# EAGLE design picopter_qc (EAGLE 6.5.0)
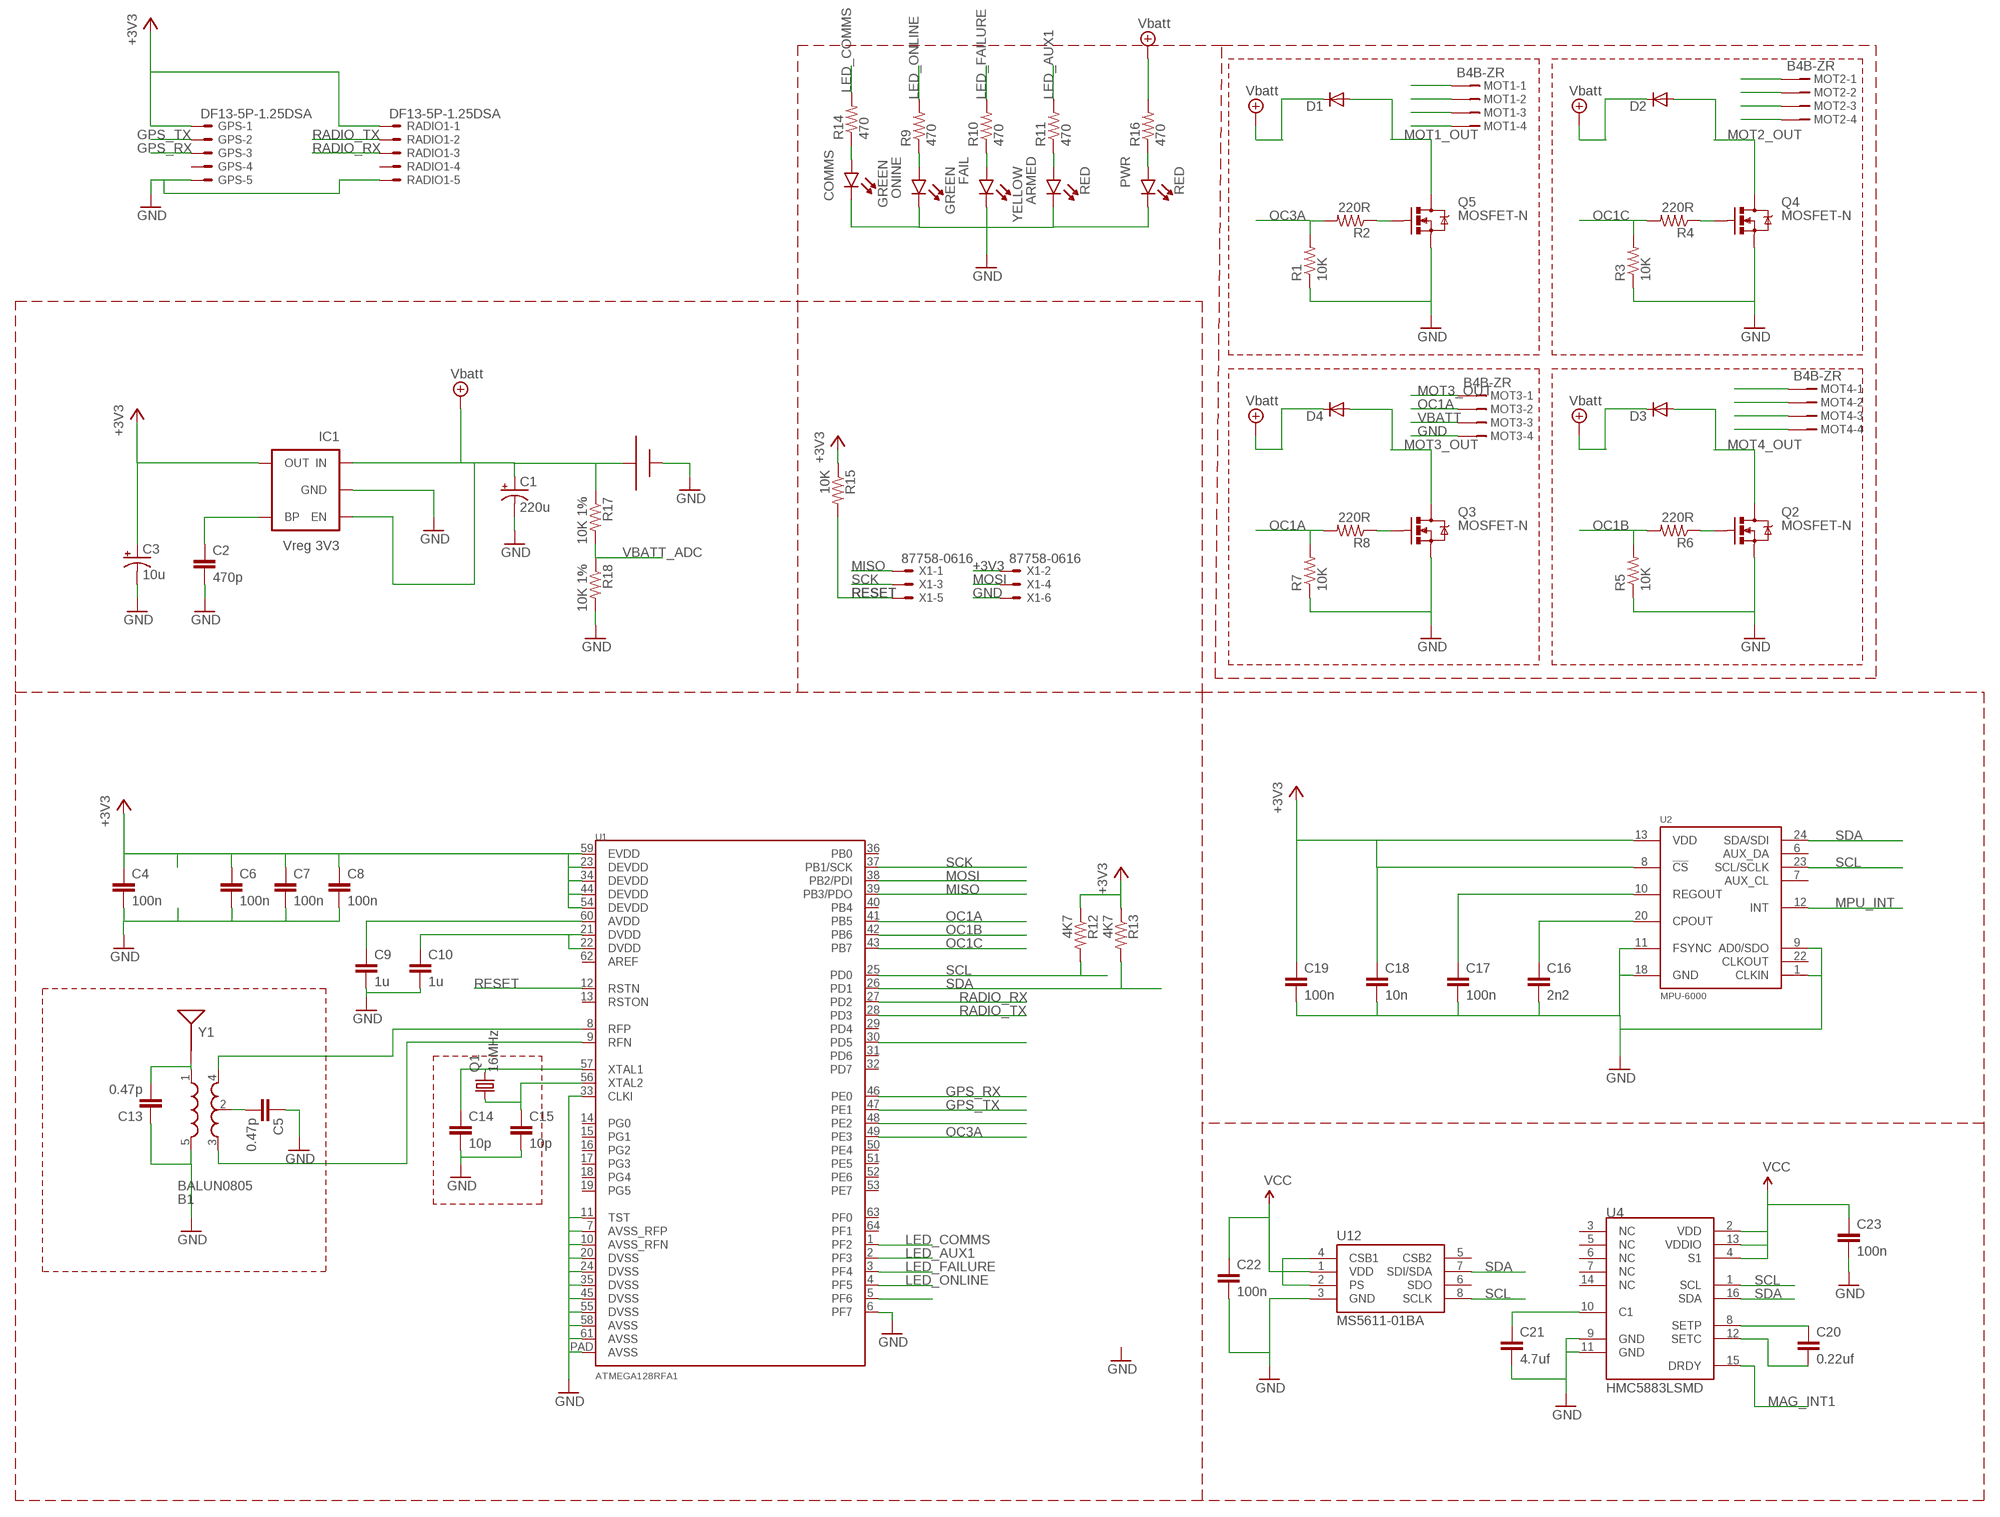
[diagram p0: schematic, sheet 1]

## Parts
ARMED  RED  SMD_LED0805  [LED0805]
B1  BALUN0805  [BALUN]
BATT1  BATT-CONNJST-PH-VERT  [JST-PH-2-VERT]
C1  220u  CPOL-USSMCB  [SMC_B]
C2  470p  C-EUC0603  [C0603]
C3  10u  CPOL-USSMCB  [SMC_B]
C4  100n  C-EUC0603  [C0603]
C5  0.47p  C-EUC0603  [C0603]
C6  100n  C-EUC0603  [C0603]
C7  100n  C-EUC0603  [C0603]
C8  100n  C-EUC0603  [C0603]
C9  1u  C-EUC0603  [C0603]
C10  1u  C-EUC0603  [C0603]
C13  0.47p  C-EUC0603  [C0603]
C14  10p  C-EUC0603  [C0603]
C15  10p  C-EUC0603  [C0603]
C16  2n2  C-EUC0603  [C0603]
C17  100n  C-EUC0603  [C0603]
C18  10n  C-EUC0603  [C0603]
C19  100n  C-EUC0603  [C0603]
C20  0.22uf  C-EUC0603  [C0603]
C21  4.7uf  C-EUC0603  [C0603]
C22  100n  C-EUC0603  [C0603]
C23  100n  C-EUC0603  [C0603]
COMMS  GREEN  SMD_LED0805  [LED0805]
D1  DIODE-MINIMELF  [MINIMELF]
D2  DIODE-MINIMELF  [MINIMELF]
D3  DIODE-MINIMELF  [MINIMELF]
D4  DIODE-MINIMELF  [MINIMELF]
FAIL  YELLOW  SMD_LED0805  [LED0805]
GPS  DF13-5P-1.25DSA  [DF13-5P-1.25DSA]
IC1  Vreg 3V3  V_REG_LDOSMD  [SOT23-5]
MOT1  B4B-ZR  [B4B-ZR]
MOT2  B4B-ZR  [B4B-ZR]
MOT3  B4B-ZR  [B4B-ZR]
MOT4  B4B-ZR  [B4B-ZR]
ONINE  GREEN  SMD_LED0805  [LED0805]
PWR  RED  SMD_LED0805  [LED0805]
Q1  16MHz  CRYSTALCTS406  [CTS406]
Q2  MOSFET-N  MOSFET-NCHANNELSMD  [SOT23-3]
Q3  MOSFET-N  MOSFET-NCHANNELSMD  [SOT23-3]
Q4  MOSFET-N  MOSFET-NCHANNELSMD  [SOT23-3]
Q5  MOSFET-N  MOSFET-NCHANNELSMD  [SOT23-3]
R1  10K  R-US_R0603  [R0603]
R2  220R  R-US_R0603  [R0603]
R3  10K  R-US_R0603  [R0603]
R4  220R  R-US_R0603  [R0603]
R5  10K  R-US_R0603  [R0603]
R6  220R  R-US_R0603  [R0603]
R7  10K  R-US_R0603  [R0603]
R8  220R  R-US_R0603  [R0603]
R9  470  RESISTOR0805-RES  [0805]
R10  470  RESISTOR0805-RES  [0805]
R11  470  RESISTOR0805-RES  [0805]
R12  4K7  R-US_R0603  [R0603]
R13  4K7  R-US_R0603  [R0603]
R14  470  RESISTOR0805-RES  [0805]
R15  10K  R-US_R0603  [R0603]
R16  470  RESISTOR0805-RES  [0805]
R17  10K 1%  R-US_R0603  [R0603]
R18  10K 1%  R-US_R0603  [R0603]
RADIO1  DF13-5P-1.25DSA  [DF13-5P-1.25DSA]
U1  ATMEGA128RFA1  [QFN-64]
U2  MPU-6000  [QFN-24]
U4  HMC5883LSMD  [16LPCC]
U12  MS5611-01BA  [MS5611-01BA]
X1  87758-0616  [87758-0616]
Y1  ANTENNA2SMD5  [ANTENNA-CHIP5]

## Nets
+3V3: C3.+ C4.1 C6.1 C7.1 C8.1 C18.1 C19.1 C22.1 C23.1 GPS.1 IC1.5(OUT) R12.1 R13.1 R15.1 RADIO1.1 U1.23(DEVDD) U1.34(DEVDD) U1.44(DEVDD) U1.54(DEVDD) U1.59(EVDD) U2.8(!CS) U2.13(VDD) U4.2(VDD) U4.4(S1) U4.13(VDDIO) U12.1(VDD) U12.2(PS) U12.4(CSB1) X1.2 ; supply symbol labelled VCC
GND: ARMED.C B1.5(GND) BATT1.N C1.- C2.2 C3.- C4.2 C5.1 C6.2 C7.2 C8.2 C9.2 C10.2 C13.1 C14.2 C15.2 C16.2 C17.2 C18.2 C19.2 C21.2 C22.2 C23.2 COMMS.C FAIL.C GPS.5 IC1.2(GND) MOT1.4 MOT2.4 MOT3.4 MOT4.4 ONINE.C PWR.C Q2.2(S) Q3.2(S) Q4.2(S) Q5.2(S) R1.1 R3.1 R5.1 R7.1 R18.2 RADIO1.5 U1.6(PF7) U1.7(AVSS_RFP) U1.10(AVSS_RFN) U1.11(TST) U1.20(DVSS) U1.24(DVSS) U1.33(CLKI) U1.35(DVSS) U1.45(DVSS) U1.55(DVSS) U1.58(AVSS) U1.61(AVSS) U1.PAD(AVSS) U2.1(CLKIN) U2.9(AD0/SDO) U2.11(FSYNC) U2.18(GND) U4.9(GND) U4.11(GND) U12.3(GND) X1.6
GPS_RX: GPS.3 U1.46(PE0)
GPS_TX: GPS.2 U1.47(PE1)
LED_AUX1: R11.2 U1.2(PF3)
LED_COMMS: R14.2 U1.1(PF2)
LED_FAILURE: R10.2 U1.3(PF4)
LED_ONLINE: R9.2 U1.4(PF5)
MAG_INT1: U1.48(PE2) U4.15(DRDY)
MISO: U1.39(PB3/PDO) X1.1
MOSI: U1.38(PB2/PDI) X1.4
MOT1_OUT: D1.A MOT1.1 Q5.3(D)
MOT2_OUT: D2.A MOT2.1 Q4.3(D)
MOT3_OUT: D4.A MOT3.1 Q3.3(D)
MOT4_OUT: D3.A MOT4.1 Q2.3(D)
MPU_INT: U1.30(PD5) U2.12(INT)
MS1: B1.1(IN) C13.2 Y1.FEED(SIGNAL)
N$1: C2.1 IC1.4(BP)
N$2: B1.2(GND) C5.2
N$4: C10.1 U1.21(DVDD) U1.22(DVDD)
N$5: C9.1 U1.60(AVDD)
N$6: B1.3(OUT1) U1.9(RFN)
N$7: B1.4(OUT2) U1.8(RFP)
N$9: C14.1 Q1.3 U1.57(XTAL1)
N$10: C15.1 Q1.1 U1.56(XTAL2)
N$12: ONINE.P$1(A) R9.1
N$13: FAIL.P$1(A) R10.1
N$15: C20.1 U4.8(SETP)
N$16: C16.1 U2.20(CPOUT)
N$17: C17.1 U2.10(REGOUT)
N$18: C20.2 U4.12(SETC)
N$19: C21.1 U4.10(C1)
N$20: ARMED.P$1(A) R11.1
N$22: COMMS.P$1(A) R14.1
N$23: PWR.P$1(A) R16.1
N$45: Q5.1(G) R2.1
N$46: Q4.1(G) R4.1
N$47: Q2.1(G) R6.1
N$48: Q3.1(G) R8.1
OC1A: MOT3.2 R7.2 R8.2 U1.41(PB5)
OC1B: MOT4.2 R5.2 R6.2 U1.42(PB6)
OC1C: MOT2.2 R3.2 R4.2 U1.43(PB7)
OC3A: MOT1.2 R1.2 R2.2 U1.49(PE3)
RADIO_RX: RADIO1.3 U1.27(PD2)
RADIO_TX: RADIO1.2 U1.28(PD3)
RESET: R15.2 U1.12(RSTN) X1.5
SCK: U1.37(PB1/SCK) X1.3
SCL: R12.2 U1.25(PD0) U2.23(SCL/SCLK) U4.1(SCL) U12.8(SCLK)
SDA: R13.2 U1.26(PD1) U2.24(SDA/SDI) U4.16(SDA) U12.7(SDI/SDA)
VBATT: BATT1.P C1.+ D1.C D2.C D3.C D4.C IC1.1(IN) IC1.3(EN) MOT1.3 MOT2.3 MOT3.3 MOT4.3 R16.2 R17.1 ; supply symbol labelled Vbatt
VBATT_ADC: R17.2 R18.1 U1.5(PF6)
Unconnected: GPS.4 RADIO1.4 U1.13(RSTON) U1.14(PG0) U1.15(PG1) U1.16(PG2) U1.17(PG3) U1.18(PG4) U1.19(PG5) U1.29(PD4) U1.31(PD6) U1.32(PD7) U1.36(PB0) U1.40(PB4) U1.50(PE4) U1.51(PE5) U1.52(PE6) U1.53(PE7) U1.62(AREF) U1.63(PF0) U1.64(PF1) U2.6(AUX_DA) U2.7(AUX_CL) U2.22(CLKOUT) U4.3(NC) U4.5(NC) U4.6(NC) U4.7(NC) U4.14(NC) U12.5(CSB2) U12.6(SDO)

## Library data of the parts
ARMED COMMS FAIL ONINE PWR = SoftwareLogisticsParts:SMD_LED0805
B1 = palmquad_alpha:BALUN
BATT1 = palmquad_alpha:BATT-CONN
C1 C3 = rcl:CPOL-US: POLARIZED CAPACITOR, American symbol
C2 C4-C10 C13-C23 = rcl:C-EU: CAPACITOR, European symbol
D1-D4 = palmquad_alpha:DIODE-: DIODE
GPS RADIO1 = pixhawk2:DF13-5P-1.25?
IC1 = palmquad_alpha:V_REG_LDO: Voltage Regulator LDO Standard 150mA LDO voltage regulator in SOT-23 layout. Micrel part MIC5205. BP (by-pass) pin is used to lower output noise with 470pF cap.
MOT1-MOT4 = con-jst:?4B-ZR: ZH CONNECTOR 1.5 mm, 4 pin 1 row Source: http://www.jst.com .. eZH.pdf; MF: FARNELL; MPN: B4B-ZR(LF)(SN); OC_FARNELL: 1830916; OC_NEWARK: 37K9960
Q1 = palmquad_alpha:CRYSTAL: CRYSTAL; OC_FARNELL: unknown; OC_NEWARK: unknown
Q2-Q5 = palmquad_alpha:MOSFET-NCHANNEL
R1-R8 R12 R13 R15 R17 R18 = rcl:R-US_: RESISTOR, American symbol
R9-R11 R14 R16 = SparkFun-Passives:RESISTOR: Resistor Basic schematic elements and footprints for 0603, 1206, and PTH resistors.
U1 = palmquad_alpha:ATMEGA128RFA1
U2 = palmquad_alpha:MPU-6000: ITG-3200 3-axis gyro, digital output, qfn24 package
U4 = SparkFun-Sensors:HMC5883L: 3 Axis Digital Compass IC
U12 = 3DRobotics:MS5611-01BA: MS5611-01BA The MS5611-01BA is a new generation of high resolution altimeter sensors from MEAS Switzerland with SPI and I 2 C bus interface. It is optimized for altimeters and variometers with an altitude resolution of 10 cm. The sensor module includes a high linearity pressure sensor and an ultra low power 24 bit ?? ADC with internal factory calibrated coefficients. It provides a precise digital 24 Bit pressure and temperature value and different operation modes that allow the user to optimize for conversion speed and current consumption. A high resolution temperature output allows the implementation of an altimeter/thermometer function without any additional sensor. The MS5611-01BA can be interfaced to virtually any microcontroller. The communication protocol is simple, without the need of programming internal registers in the device. Small dimensions of only 5.0 mm x 3.0 mm and a height of 1.7 mm allow for integration in mobile devices. This new sensor module generation is based on leading MEMS technology and latest benefits from MEAS Switzerland proven experience and know-how in high volume manufacturing of altimeter modules, which have been widely used for over a decade. The sensing principle employed leads to very low hysteresis and high stability of both pressure and temperature signal. High resolution module, 10 cm Fast conversion down to 1 ms Low power, 1 µA (standby < 0.15 µA) QFN package 5.0 x 3.0 x 1.7 mm3 Supply voltage 1.8 to 3.6 V Integrated digital pressure sensor (24 bit ?? ADC) Operating range: 10 to 1200 mbar, -40 to +85 °C I2C and SPI interface up to 20 MHz No external components (Internal oscillator) Excellent long term stability; DATASHEET: http://www.meas-spec.com/downloads/MS5611-01BA01.pdf; LINK: http://www.meas-spec.com/product/t_product.aspx?id=8503#; MFGPN: MS5611-01BA
X1 = con-molex:87758-0616: 6 Pin - 2mm Dual Row Single Wafer, Vertical T/H HDR Source: http://www.molex.com/pdm_docs/sd/877580616_sd.pdf; MPN: 87758-0616; OC_FARNELL: 7472323; OC_NEWARK: 25M5667
Y1 = palmquad_alpha:ANTENNA2: Antenna Single endded antenna. Common with smaller chip antennas. CHIP4 package is the GPS Chip Antenna SKU: GPS-08418. CHIP5 package is 2.4GHz chip antenna SKU: WRL-00144.

## Board
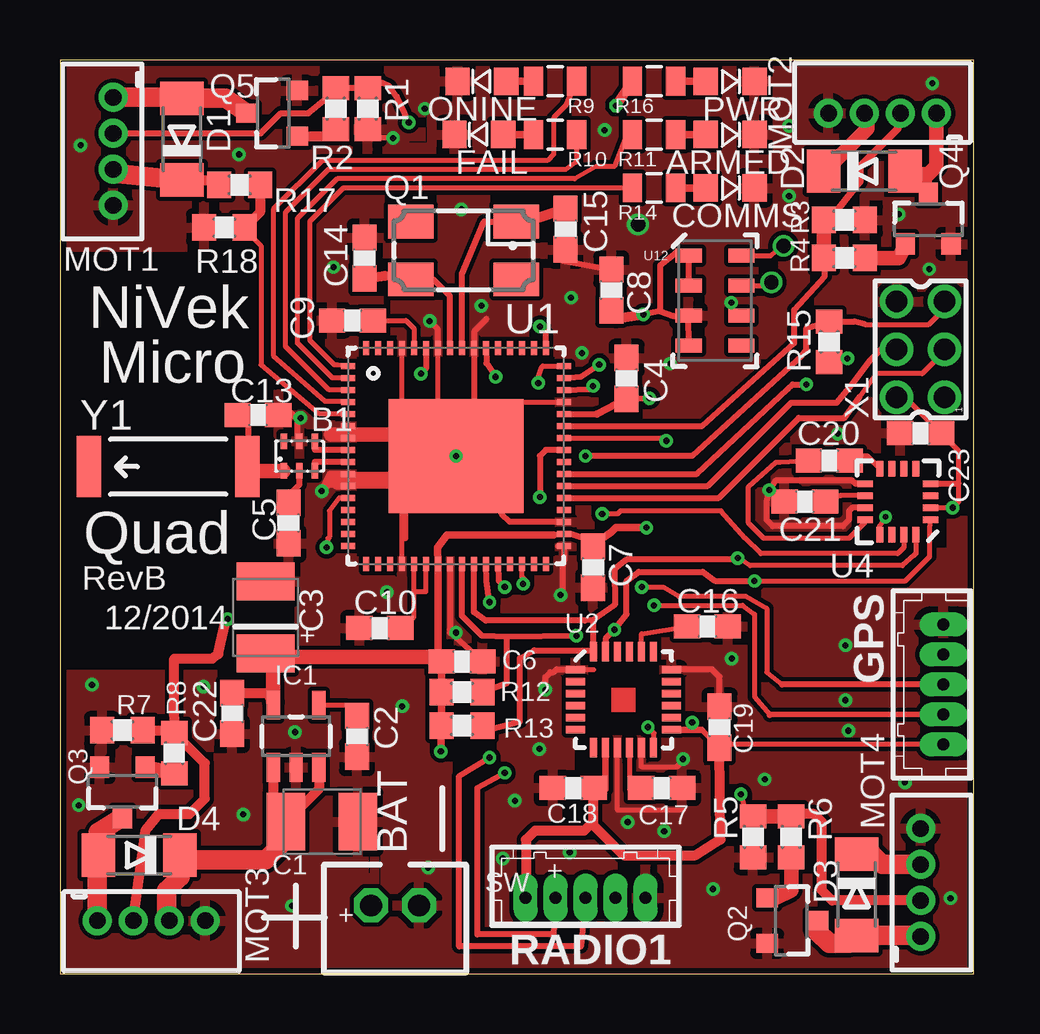
[diagram p1: board, top side]
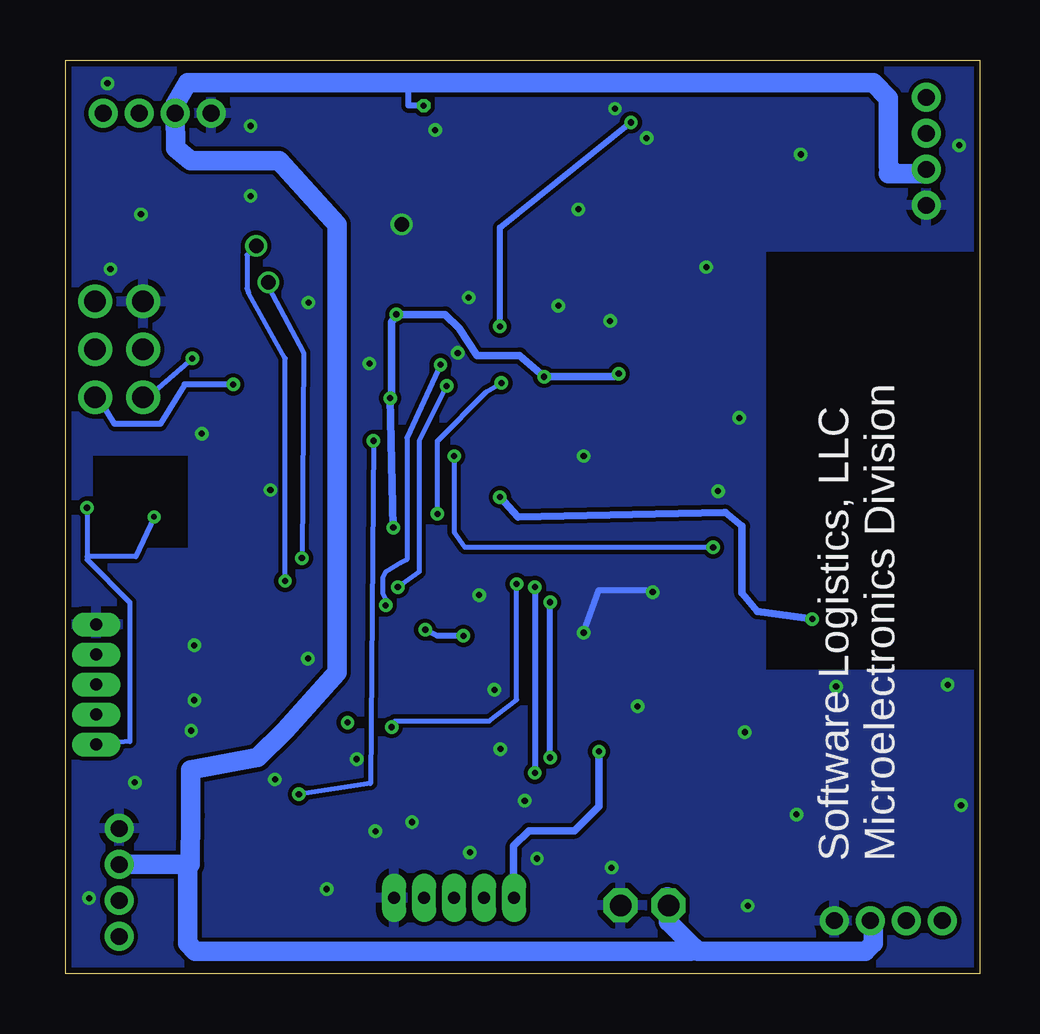
[diagram p2: board, bottom side, seen from below]

Size 38.1 x 38.1 mm. Coordinates in mm from the lower left corner, seen from the top.
Outline: 0,38.1 0,0 38.1,0 38.1,38.1 0,38.1
Copper layers (1*16): Top 0.035mm / dielectric 1.5mm / Bottom 0.035mm
Design rules "fusion_rules_tentedvias *": minimum track width 6mil, minimum drill 10mil, track to track 7mil, track to pad 7mil, pad to pad 7mil, via to via 7mil, smd to smd 0mil, copper to edge 10mil, drill to drill 10mil, minimum pad ring 10mil, minimum via ring 6mil, stop-mask expansion 2mil, vias tented up to drill 12mil, thermal gap 10mil
tRestrict: area 12.4,17.4 to 20.6,25.7; area 22,10 to 25,12.9; area 33,17.8 to 37,21.6; area 0.1,12.7 to 8.9,30.1; 25 lines
bRestrict: area 33,17.8 to 37,21.6; area 0.1,12.7 to 8.9,30.1

### Footprints (pad centres in the part's own frame; a part is rotated, then mirrored left to right if it is on the bottom)
LED0805 = smd 1.143 x 1.016: C 0,1.016; P$1 0,-1.016
BALUN = smd 0.27 x 0.635: 1 -0.7,-0.616; 2 -0.05,-0.616; 3 0.6,-0.616; 4 0.6,0.616; 5 -0.05,0.616; 6 -0.7,0.616
JST-PH-2-VERT = drill 0.9 pad 1.422 octagon: N -1,0; P 1,0
SMC_B = smd 1.6 x 2.4: + -1.5,0; - 1.5,0
C0603 = smd 1.1 x 1: 1 -0.85,0; 2 0.85,0
MINIMELF = smd 1.4 x 1.8: A 1.7,0; C -1.7,0
DF13-5P-1.25DSA = drill 0.5 pad 0.8 long: 1 -2.5,0; 2 -1.25,0; 3 0,0; 4 1.25,0; 5 2.5,0
SOT23-5 = smd 0.55 x 1.2: 1 -0.95,-1.3; 2 0,-1.3; 3 0.95,-1.3; 4 0.95,1.3; 5 -0.95,1.3
B4B-ZR = drill 0.7 pad 1.1: 1 -2.25,0; 2 -0.75,0; 3 0.75,0; 4 2.25,0
CTS406 = smd 1.9 x 1.4: 1 -2.2,-1.2; 2 2.2,-1.2; 3 2.2,1.2; 4 -2.2,1.2
SOT23-3 = smd 0.8 x 0.9: 1 -0.95,-1; 2 0.95,-1; 3 0,1.1
R0603 = smd 1 x 1.1: 1 -0.85,0; 2 0.85,0
0805 = smd 0.8 x 1.2: 1 -0.9,0; 2 0.9,0
QFN-64 = smd 0.6 x 0.25: 1 -4.5,3.75; 2 -4.5,3.25; 3 -4.5,2.75; 4 -4.5,2.25; 5 -4.5,1.75; 6 -4.5,1.25; 7 -4.5,0.75; 8 -4.5,0.25; 9 -4.5,-0.25; 10 -4.5,-0.75; 11 -4.5,-1.25; 12 -4.5,-1.75; 13 -4.5,-2.25; 14 -4.5,-2.75; 15 -4.5,-3.25; 16 -4.5,-3.75; 33 4.5,-3.75; 34 4.5,-3.25; 35 4.5,-2.75; 36 4.5,-2.25; 37 4.5,-1.75; 38 4.5,-1.25; 39 4.5,-0.75; 40 4.5,-0.25; 41 4.5,0.25; 42 4.5,0.75; 43 4.5,1.25; 44 4.5,1.75; 45 4.5,2.25; 46 4.5,2.75; 47 4.5,3.25; 48 4.5,3.75 | smd 0.25 x 0.6: 17 -3.75,-4.5; 18 -3.25,-4.5; 19 -2.75,-4.5; 20 -2.25,-4.5; 21 -1.75,-4.5; 22 -1.25,-4.5; 23 -0.75,-4.5; 24 -0.25,-4.5; 25 0.25,-4.5; 26 0.75,-4.5; 27 1.25,-4.5; 28 1.75,-4.5; 29 2.25,-4.5; 30 2.75,-4.5; 31 3.25,-4.5; 32 3.75,-4.5; 49 3.75,4.5; 50 3.25,4.5; 51 2.75,4.5; 52 2.25,4.5; 53 1.75,4.5; 54 1.25,4.5; 55 0.75,4.5; 56 0.25,4.5; 57 -0.25,4.5; 58 -0.75,4.5; 59 -1.25,4.5; 60 -1.75,4.5; 61 -2.25,4.5; 62 -2.75,4.5; 63 -3.25,4.5; 64 -3.75,4.5 | smd 5.639 x 4.75: PAD 0,0
QFN-24 = smd 0.8 x 0.3: 1 -2,1.25; 2 -2,0.75; 3 -2,0.25; 4 -2,-0.25; 5 -2,-0.75; 6 -2,-1.25; 13 2,-1.25; 14 2,-0.75; 15 2,-0.25; 16 2,0.25; 17 2,0.75; 18 2,1.25 | smd 0.3 x 0.8: 7 -1.25,-2; 8 -0.75,-2; 9 -0.25,-2; 10 0.25,-2; 11 0.75,-2; 12 1.25,-2; 19 1.25,2; 20 0.75,2; 21 0.25,2; 22 -0.25,2; 23 -0.75,2; 24 -1.25,2
16LPCC = smd 0.65 x 0.28: 1 -1.37,0.75; 2 -1.37,0.25; 3 -1.37,-0.25; 4 -1.37,-0.75; 9 1.37,-0.75; 10 1.37,-0.25; 11 1.37,0.25; 12 1.37,0.75 | smd 0.28 x 0.65: 5 -0.75,-1.37; 6 -0.25,-1.37; 7 0.25,-1.37; 8 0.75,-1.37; 13 0.75,1.37; 14 0.25,1.37; 15 -0.25,1.37; 16 -0.75,1.37
MS5611-01BA = smd 1.1 x 0.6: 1 -1.1,1.875; 2 -1.1,0.625; 3 -1.1,-0.625; 4 -1.1,-1.875; 5 1.1,-1.875; 6 1.1,-0.625; 7 1.1,0.625; 8 1.1,1.875
87758-0616 = drill 0.9 pad 1.27: 1 -2,-1; 2 -2,1; 3 0,-1; 4 0,1; 5 2,-1; 6 2,1
ANTENNA-CHIP5 = smd 1.016 x 2.54: FEED -3.302,0; NC 3.302,0

### Placement (x,y rotation side)
ARMED  27.94,34.99 270 top
B1  10.03,21.59 0 top
BATT1  13.97,2.86 180 top
C1  10.92,6.35 0 top
C2  12.38,9.91 270 top
C3  8.57,14.86 90 top
C4  23.62,24.83 90 top
C5  9.53,18.8 90 top
C6  16.76,13.02 0 top
C7  22.23,16.95 270 top
C8  22.99,28.51 90 top
C9  12.19,27.24 180 top
C10  13.34,14.41 180 top
C13  8.26,23.3 180 top
C14  12.7,29.84 90 top
C15  21.08,31.05 270 top
C16  26.99,14.48 0 top
C17  25.08,7.75 0 top
C18  21.4,7.75 180 top
C19  27.5,10.29 90 top
C20  32.07,21.4 180 top
C21  31.05,19.68 180 top
C22  7.18,10.86 270 top
C23  35.88,22.54 180 top
COMMS  27.94,32.77 270 top
D1  5.08,34.8 90 top
D2  33.53,33.46 0 top
D3  33.21,3.3 270 top
D4  3.3,4.95 180 top
FAIL  17.46,34.99 90 top
GPS  36.83,12.06 90 top
IC1  9.84,9.91 0 top
MOT1  2.22,34.29 270 top
MOT2  34.29,35.88 180 top
MOT3  3.81,2.22 0 top
MOT4  35.88,3.81 90 top
ONINE  17.59,37.21 90 top
PWR  27.94,37.21 270 top
Q1  16.83,30.16 180 top
Q2  30.48,2.22 270 top
Q3  2.6,7.62 180 top
Q4  36.2,31.43 0 top
Q5  8.89,35.88 90 top
R1  12.83,36.07 90 top
R2  11.49,36.07 90 top
R3  32.7,31.43 180 top
R4  32.7,29.84 180 top
R5  28.89,5.71 90 top
R6  30.48,5.71 90 top
R7  2.6,10.16 0 top
R8  4.76,9.21 90 top
R9  20.64,37.21 0 top
R10  20.64,34.99 0 top
R11  24.77,34.99 180 top
R12  16.76,11.75 0 top
R13  16.76,10.35 0 top
R14  24.77,32.77 180 top
R15  32.07,26.35 90 top
R16  24.77,37.21 180 top
R17  7.49,32.89 0 top
R18  6.86,31.11 180 top
RADIO1  21.91,3.17 0 top
U1  16.51,21.59 0 top
U2  23.5,11.43 0 top
U4  34.92,19.68 180 top
U12  27.3,28.07 0 top
X1  35.88,26.04 90 top
Y1  4.51,21.15 180 top

### Tracks (layer width: path | path; a pad name or v marks a point on that pad's centre or on a via)
+3V3  (via drill 0.23, 0.25)
  Top 0.203: 22.23,18.21 C7.1 22.52,18.1 | 22.75,7.68 C18.1 22.23,7.72 | C19.1 26.75,10.18 | 27.56,9.34 27.18,9.34 C19.1 | 15.91,11.81 15.66,11.75 R12.1 | 15.91,10.24 15.98,10.13 | X1.2 35.23,24.04 C23.1 37.47,21.8 37.47,20.45 37.47,19.68 v37.22,19.43 U4.2 | v32.83,25.65 32.17,25.4 R15.1 | 26.35,26.17 U12.4 | GPS.1 27.37,9.56 C19.1 | 26.33,10.18 v26.35,10.48 | U4.13 34.17,18.68 v34.42,19.05
  Top 0.254: 22.23,18.21 21.84,18.16 21.28,18.34 U1.34 20.57,18.29 | U1.44 22.39,23.34 | C4.1 v24.57,24 | U1.59 15.26,25.23 v15.05,25.02 | 25.02,27.62 25.02,29.53 25.69,30.07 U12.1 U12.2 | 25.02,27.62 25.59,27.43 26.18,27.43 U12.4 | 25.02,27.62 v24.32,27.5 | U1.54 17.78,25.45 v18.16,24.89 | U4.4 36.3,20.45 37.47,20.45
  Top 0.279: 26.75,10.18 26.33,10.18 U2.13 | U2.8 22.75,7.68
  Top 0.305: 22.39,23.34 C4.1 | 8.89,13.21 8.89,13.36 C3.+ 8.89,13.04 | IC1.5 8.89,11.33 | 15.91,13.21 C6.1 | C6.1 R12.1 | 15.98,10.13 R13.1 | 15.91,11.81 R12.1 | R12.1 R13.1 | R13.1 15.91,10.24 | v15.88,9.27 R13.1 | 20.57,18.29 16.13,18.29 15.75,17.78 U1.23 15.76,13.17 C6.1 | v24.45,18.61 23.18,18.61 22.99,18.41 22.52,18.1
  Top 0.406: C22.1 8.63,11.71 IC1.5 | v24.32,27.5 23.18,27.3 22.95,27.53 | 22.95,27.53 22.86,27.62 | C19.1 27.54,5.61 26.5,4.95 23.5,4.95 22.23,6.22 22.23,6.35 | 22.23,7.72 22.23,6.35 | 22.23,6.35 21.84,5.97 19.8,5.97 19.42,5.59 19.42,3.19 RADIO1.1 | C8.1 22.95,27.66 22.95,27.53
  Top 0.61: 15.91,13.21 8.89,13.21 8.89,11.33
  Bottom 0.203: X1.2 34.7,24.04 v32.83,25.65 | v37.22,19.43 37.22,17.4 | 37.22,17.4 37.22,17.28 35.43,15.49 35.43,9.69 GPS.1 | v34.42,19.05 35.18,17.4 37.22,17.4
  Bottom 0.305: v15.05,25.02 15.24,24.89 v18.16,24.89 19.18,25.78 20.95,25.78 21.72,26.92 22.29,27.5 v24.32,27.5 24.51,27.18 24.51,24 v24.57,24 v24.45,18.61 | RADIO1.1 19.43,4.95 19.43,5.33 18.8,5.97 16.89,5.97 15.88,6.99 v15.88,9.27
GND  (via drill 0.25, 0.6)
  Top 0.203: 14.26,17.27 14.26,19.3 14.26,19.46 | 18.77,23.84 20.96,23.84 | 17.27,23.77 17.27,25.91 17.27,25.95 | 15.76,23.72 15.76,25.91 | 14.26,23.75 14.26,25.93 | 12.09,20.84 14.27,20.84 | 12.14,20.34 14.33,20.34 | 12.11,22.34 14.3,22.34 | 20.73,17.83 20.8,17.83 | 22.25,12.68 21.69,12.68 | 16.26,17.14 16.26,17.18 | 24.24,9.21 24.24,8.63 25.71,8.63 | U2.9 23.25,6.83 25.98,6.83 | v10.02,23.18 9.97,23.18 9.91,23.11
  Top 0.254: U1.45 20.96,23.84 | 18.77,23.84 17.33,23.84 17.27,23.77 | 17.27,25.91 17.26,25.91 U1.55 17.26,23.63 17.27,23.62 15.86,23.62 15.76,23.72 | 15.76,25.91 U1.58 15.76,26.87 v15.41,27.22 | U1.61 14.26,25.93 | 14.26,22.73 14.26,22.48 14.26,19.31 14.26,19.3 | 14.26,19.46 14.26,19.65 14.22,19.68 14.22,20.24 14.33,20.34 | 12.14,20.34 U1.11 | U1.11 | 11.88,20.34 | 14.39,22.48 14.39,22.61 14.26,22.73 | 14.39,22.48 14.39,18.16 | 14.26,23.75 14.26,22.73 | 14.3,22.34 14.3,22.39 14.39,22.48 | 12.11,22.34 U1.7 U1.6 | v13.89,34.84 12.87,34.88 12.95,35.43 R1.1 | 20.8,17.83 U1.33 21.01,17.2 20.95,17.14 20.95,15.88 v20.87,15.79 | U1.24 16.26,17.14 16.26,14.22 v16.51,14.22 16.26,14.35 16.28,14.22 C6.2 | 14.26,17.27 U1.20 | 21.69,12.68 U2.1 21.48,12.7 20.7,12.7 20.57,12.57 20.45,12.57 20.24,12.36 v20.24,11.84 | C19.2 27.5,12.38 27.18,12.7 25.52,12.7 U2.18 | v25.97,8.95 25.97,8.89 25.71,8.63 | U2.11 24.25,9.22 24.24,9.21 | U2.9 | U4.9 33.16,20.43 33.02,20.57 29.83,20.56 v29.57,20.17 29.46,19.69 29.46,18.92 29.72,18.67 32.64,18.67 32.89,18.92 32.89,19.3 33.02,19.43 U4.11 | 12.09,20.84 U1.10 11.24,20.84 v10.91,20.13 11.37,20.51 11.54,20.34 11.88,20.34 | U1.11 11.88,20.34 | C15.2 20.95,29.74 C8.2 | U1.35 18.75,18.84 18.41,19.18 18.41,20.57 17.78,21.21 16.89,21.21 U1.PAD | 17.27,26.04 17.27,26.8 17.78,27.3 | B1.5 9.91,22.28 9.91,23.11 9.49,23.53 C13.1
  Top 0.305: 11.3,20.57 11.54,20.34 U1.11
  Top 0.61: 11.3,22.48 14.26,22.48 | 11.3,20.57 14.86,20.57
  Bottom 0.254: v16.51,14.22 15.88,16 13.72,16 13.59,15.75 13.55,15.88 v13.63,15.92
  other vias: 17.57,27.86 1.33,12.06 15.35,4.43 32.75,13.7 14.27,11.16 21.76,25.89 18.46,4.81 5.99,11.98 16.51,21.59 25.44,25.44 32.43,22.52 36.36,37.13 36.24,29.38 9.67,2.84 7.64,6.65 0.78,7.03 37.13,3.16 27.98,27.98 25.19,5.95 21.25,5.06 28,13.14 15.21,36.07 7.46,34.16 11.4,29.46 32.75,11.41 32.87,10.14 22.7,35.18 24.1,31.24 16.73,31.88 0.86,34.54 30.4,35.35 34.97,31.67 30.4,32.43 21.3,28.19 29.38,8.11 35.22,7.98 27.22,3.54 23.66,6.33 19.98,9.38 18.97,7.22 9.8,10.08
  pour Top: -0.13,38.23 37.97,38.23 38.1,38.1 38.1,0.13 0.25,0.13 0.13,0
  pour Bottom: -0.51,38.23 38.1,38.23 38.23,38.35 38.23,-0.38 38.48,-0.64 -0.64,-0.64
GPS_RX  (via drill 0.25)
  Top 0.203: 22.1,24.38 v22.23,24.51 | v24.26,16.13 25.15,16.13 25.78,15.75 28.57,15.75 29.46,15.24 29.46,12.57 30.1,12.06
  Top 0.254: GPS.3 30.1,12.06 | U1.46 22.1,24.38
  Bottom 0.203: v22.23,24.51 23.37,22.23 23.37,16.76 v24.26,16.13
GPS_TX  (via drill 0.25)
  Top 0.203: v24.77,15.37 28.45,15.37 28.96,14.99 28.96,11.56 29.59,10.79
  Top 0.254: GPS.2 29.59,10.79 | U1.47 21.72,24.89 v22.48,25.4
  Bottom 0.203: v22.48,25.4 23.88,22.35 23.88,17.27 24.13,17.14 24.77,16.76 24.89,16.51 24.89,15.88 24.77,15.62 v24.77,15.37
LED_AUX1
  Top 0.203: R11.2 23.69,35.12 23.11,33.66 22.35,33.66 21.46,33.15 11.56,33.15 9.91,31.5 9.91,26.29 11.36,24.84 U1.2
LED_COMMS
  Top 0.203: R14.2 11.81,32.77 10.41,31.37 10.41,26.42 11.43,25.4 11.57,25.4 U1.1
LED_FAILURE
  Top 0.203: R10.2 21.54,33.86 21.08,33.53 11.18,33.53 9.4,31.75 9.4,26.16 11.22,24.34 U1.3
LED_ONLINE
  Top 0.203: R9.2 21.08,36.2 20.57,35.69 20.57,34.16 20.32,33.91 10.92,33.91 8.89,31.88 8.89,25.78 11.05,23.88 11.97,23.88 U1.4
MAG_INT1  (via drill 0.25)
  Top 0.203: U4.15 35.18,17.78 34.92,17.53 29.21,17.53 28.57,18.16 27.56,19.3 23.37,19.3 23.24,19.18 v22.61,19.18 | v19.94,24.64 19.94,24.89 20.07,25.27 20.13,25.34 U1.48
  Bottom 0.203: v22.61,19.18 22.61,22.23 20.57,24.26 v19.94,24.64
MISO  (via drill 0.25)
  Top 0.254: U1.39 26.55,20.84 30.35,24.38 30.54,24.57 v31.11,24.57
  Bottom 0.254: v31.11,24.57 33.15,24.57 34.16,22.92 36.07,22.92 36.64,23.88 36.51,23.67 X1.1
MOSI
  Top 0.254: U1.38 27.01,20.34 30.48,23.81 32.38,23.81 33.02,24.57 33.78,25.59 34.23,26.04 X1.4
MOT1_OUT
  Top 0.813: MOT1.1 4.74,36.54 D1.A 6.92,36.5 Q5.3
MOT2_OUT
  Top 0.61: Q4.3 36.01,33.15 36.2,33.34 | 36.2,33.34 35.04,33.34 D2.A | MOT2.1 36.54,33.68 36.2,33.34
MOT3_OUT
  Top 0.813: MOT3.1 1.56,4.91 D4.A 1.6,5.9 Q3.3
MOT4_OUT
  Top 0.813: Q2.3 31.58,1.76 32.07,1.27 32.88,1.27 D3.A 35.84,1.6 MOT4.1
MPU_INT  (via drill 0.25)
  Top 0.203: U2.12 24.77,9.43 24.77,10.03 v24.51,10.29 | v19.3,16.26 19.43,16.38 19.26,16.55 U1.30
  Bottom 0.203: v24.51,10.29 24.38,10.54 20.45,10.54 19.3,11.43 v19.3,16.26
MS1
  Top 0.254: 8.06,20.97 Y1.FEED 7.87,21.4 7.87,23.24 7.34,23.24 C13.2
  Top 0.61: B1.1 8.06,20.97
N$1
  Top 0.203: IC1.4 11.93,11.21 C2.1
N$2
  Top 0.254: C5.2 9.53,19.94 9.98,20.4 B1.2
N$4
  Top 0.203: C10.1 14.76,14.86 14.76,15.94 | 14.76,15.94 U1.21 | U1.22 15.26,15.94 14.76,15.94
N$5
  Top 0.203: C9.1 14.43,27.24 14.76,26.91 U1.60
N$6
  Top 0.254: U1.9 10.63,21.34 B1.3
N$7
  Top 0.254: U1.8 10.63,21.84 B1.4
N$9
  Top 0.203: 15.55,28.96 Q1.3
  Top 0.254: U1.57 16.26,28.26 15.55,28.96
  Top 0.305: 13.55,29.11 13.97,29.21 14.38,29.21 Q1.3
  Top 0.406: C14.1 13.55,29.11
N$10
  Top 0.203: Q1.1 arc90 19.59,31.43
  Top 0.254: U1.56 16.76,29.17 17.68,31.36 Q1.1
  Top 0.406: 19.59,31.43 C15.1
N$12
  Top 0.305: ONINE.P$1 R9.1
N$13
  Top 0.305: R10.1 FAIL.P$1
N$15
  Top 0.203: U4.8 34.17,21.07 33.66,21.59 32.6,21.59 C20.1
N$16
  Top 0.203: U2.20 24.25,14.17 C16.1
N$17
  Top 0.203: U2.10 23.75,7.68 C17.1
N$18
  Top 0.203: U4.12 33.55,18.82 32.89,18.16 29.34,18.16 28.7,18.8 28.7,20.32 29.84,21.34 30.01,21.34 C20.2
N$19
  Top 0.203: U4.10 32.53,19.93 C21.1
N$20
  Top 0.305: R11.1 ARMED.P$1
N$22
  Top 0.305: R14.1 COMMS.P$1
N$23
  Top 0.305: R16.1 PWR.P$1
N$45
  Top 0.406: Q5.1 11.33,34.93 R2.1
N$46
  Top 0.61: R4.1 34.98,29.84 Q4.1
N$47
  Top 0.61: Q2.1 29.84,3.17 30.48,3.49 R6.1
N$48
  Top 0.61: R8.1 4.15,8.48 3.81,8.57 3.6,8.7 Q3.1
OC1A  (via drill 0.25)
  Top 0.254: U1.41 20.25,21.84 20,21.59 v20,19.88
  Top 0.406: MOT3.2 3.57,5.98 4.13,6.67 5.4,6.67 6.03,7.3 6.03,8.79 R8.2 | R7.2 4.66,10.16 R8.2 | v6.99,14.8 6.92,14.8 6.6,13.34 6.35,13.14 4.76,13.14 4.76,11.3 4.79,10.16 | 4.79,10.06 4.79,10.16 | R8.2 4.76,10.14 4.79,10.16
  Bottom 0.305: v20,19.88 19.24,19.05 10.65,19.23 10.6,19.23 9.91,18.67 9.91,15.88 9.27,15.11 v6.99,14.8
OC1B  (via drill 0.25)
  Top 0.203: U1.42 25.29,22.34 v25.27,22.23 | v28.38,7.49 28.68,6.35 R5.2
  Top 0.406: MOT4.2 32.18,3.06 31.75,3.49 31.75,6.35 31.43,6.67 30.58,6.67 R6.2
  Top 0.61: R5.2 R6.2
  Bottom 0.203: v25.27,22.23 25.4,7.94 v28.38,7.49
OC1C
  Top 0.203: 31.88,29.82 R4.2
  Top 0.254: U1.43 26.78,22.84 30.61,26.29 30.61,27.69 31.88,29.08 31.88,29.82
  Top 0.305: R3.2 32.07,31.43 33.34,33.02 33.34,33.66 34.92,35.24 34.92,35.76 MOT2.2
  Top 0.61: R4.2 R3.2
OC3A  (via drill 0.25)
  Top 0.254: MOT1.2 8.37,35.04 9.21,35.88 10.35,35.88 11.11,36.51 11.47,36.89 R2.2 R1.2 13.44,37.15 13.72,37.02 14.03,36.58 v14.54,35.5 | U1.49 20.26,26.73 v20,26.99
  Bottom 0.254: v20,26.99 20,31.11 v14.54,35.5
RADIO_RX  (via drill 0.25)
  Top 0.254: RADIO1.3 21.72,1.14 16.64,1.14 16.64,8.26 v17.91,9.02 | v17.91,15.49 17.78,16.38 U1.27
  Bottom 0.254: v17.91,9.02 v17.91,15.49
RADIO_TX  (via drill 0.25)
  Top 0.254: RADIO1.2 20.57,1.65 17.4,1.65 17.4,7.75 v18.54,8.38 | U1.28 18.29,16.38 v18.54,16.13
  Bottom 0.254: v18.54,16.13 v18.54,8.38
RESET  (via drill 0.25)
  Top 0.203: U1.12 11.64,19.84 11.24,19.31 11.24,18.22 11.18,18.16 v11.11,17.78 | X1.5 36.88,27.73 36.2,27.05 33.58,27.05 33.53,27.1
  Top 0.254: v21.91,21.59 26.35,21.59 30.92,25.78 31.11,26.04 31.11,26.92 R15.2 33.12,27.2 33.53,27.1
  Bottom 0.203: v11.11,17.78 21.46,17.78 21.91,18.41 v21.91,21.59
SCK
  Top 0.203: X1.3 36.88,25.96 35.94,25.02 34.04,25.02 33.34,24.07
  Top 0.254: U1.37 27.46,19.84 30.8,23.18 32.7,23.18 33.34,24.07
SCL  (via drill 0.25, 0.6)
  Top 0.203: v28.96,16.38 35.24,16.38 36.26,17.4 36.26,18.59 U4.1 | U12.8 29.62,29.94 v30.16,30.35
  Top 0.254: U1.25 16.76,14.93 17.6,14.1 18.67,14.06 | U2.23 22.75,13.98 v23.11,14.35 23.62,14.99 23.62,16.38 24.13,16.76 26.8,16.76 27.3,16.38 v28.96,16.38 | v21.53,14.1 18.67,14.06 | R12.2 18.63,12.13 18.63,13.99 18.67,14.06
  Bottom 0.203: v30.16,30.35 30.54,29.97 30.54,28.57 30.48,28.38 28.96,25.65 v28.96,16.38
  Bottom 0.254: v21.53,14.1 22.61,14.1 v23.11,14.35
SDA  (via drill 0.25, 0.6)
  Top 0.203: 22.25,13.49 U2.24 | 17.36,9.94 R13.2 17.99,10.22 | U4.16 35.67,18.21 35.69,17.53 35.62,17.46 35.12,17.02 28.77,17.02 28.38,17.27 v28.26,17.34 | U12.7 29.26,28.69 v29.65,28.83
  Top 0.254: 22.25,14.75 22.25,13.49 19.77,13.49 19.18,13.16 19.18,10.52 17.99,10.22 | 22.25,14.75 21.88,14.73 17.74,14.73 17.26,15.09 U1.26 | 28.38,17.27 23.62,17.27 23.11,16.89 23.13,15.38 22.25,14.75
  Bottom 0.203: v29.65,28.83 29.65,28.64 28.19,25.91 v28.26,17.34
VBATT  (via drill 0.25)
  Top 0.406: IC1.1 8.89,6.88 C1.+ 10.79,7.72 IC1.3 | R16.2 v23.18,36.2 | D1.C 6.64,33.1 R17.1
  Top 0.61: D2.C 31.88,33.47 33.66,35.24 33.66,35.76 MOT2.3
  Top 0.813: D1.C 2.41,33.35 MOT1.3 | MOT3.3 4.45,2.34 4.45,3.49 5,4.05 D4.C 5.19,4.76 8.57,4.76 9.42,5.61 C1.+ | D3.C 33.85,5 34.29,4.56 MOT4.3
  Bottom 0.254: v23.18,36.2 23.81,36.2 23.81,37.15
  Bottom 0.813: 4.76,2.22 MOT3.3 4.45,2.11 4.45,1.27 4.76,0.95 11.75,0.95 11.91,1.11 | 3.81,33.35 3.49,33.35 | 3.49,33.35 2.41,33.35 MOT1.3 | BATT1.P 12.97,2.9 | 13.02,3.22 BATT1.P | 3.49,33.35 3.81,33.67 3.81,36.51 4.45,37.15 23.81,37.15 33.02,37.15 33.54,36.25 MOT2.3 33.53,34.42 32.89,33.91 29.21,33.91 26.8,31.24 26.8,12.57 28.96,10.16 30.1,9.02 32.89,8.51 32.89,6.6 32.91,4.56 | BATT1.P 12.97,2.17 11.91,1.11 | MOT4.3 32.91,4.56 | 11.91,1.11 12.06,0.95 32.7,0.95 33.02,1.27 33.02,4.45 32.91,4.56
VBATT_ADC
  Top 0.203: 7.71,31.03 8.38,30.35 8.38,25.4 10.79,23.37 11.98,23.37 U1.5
  Top 0.406: R17.2 8.34,31.75 R18.1 7.71,31.03

### Text on the board
_tsilk: NiVek | Micro | Quad | RevB | 12/2014 | + | BAT | + | SW | +
_bsilk: Software Logistics, LLC / Microelectronics Division